# Altium project Zynq7000_Eval_Board.PrjPcb (part 1 of 2)
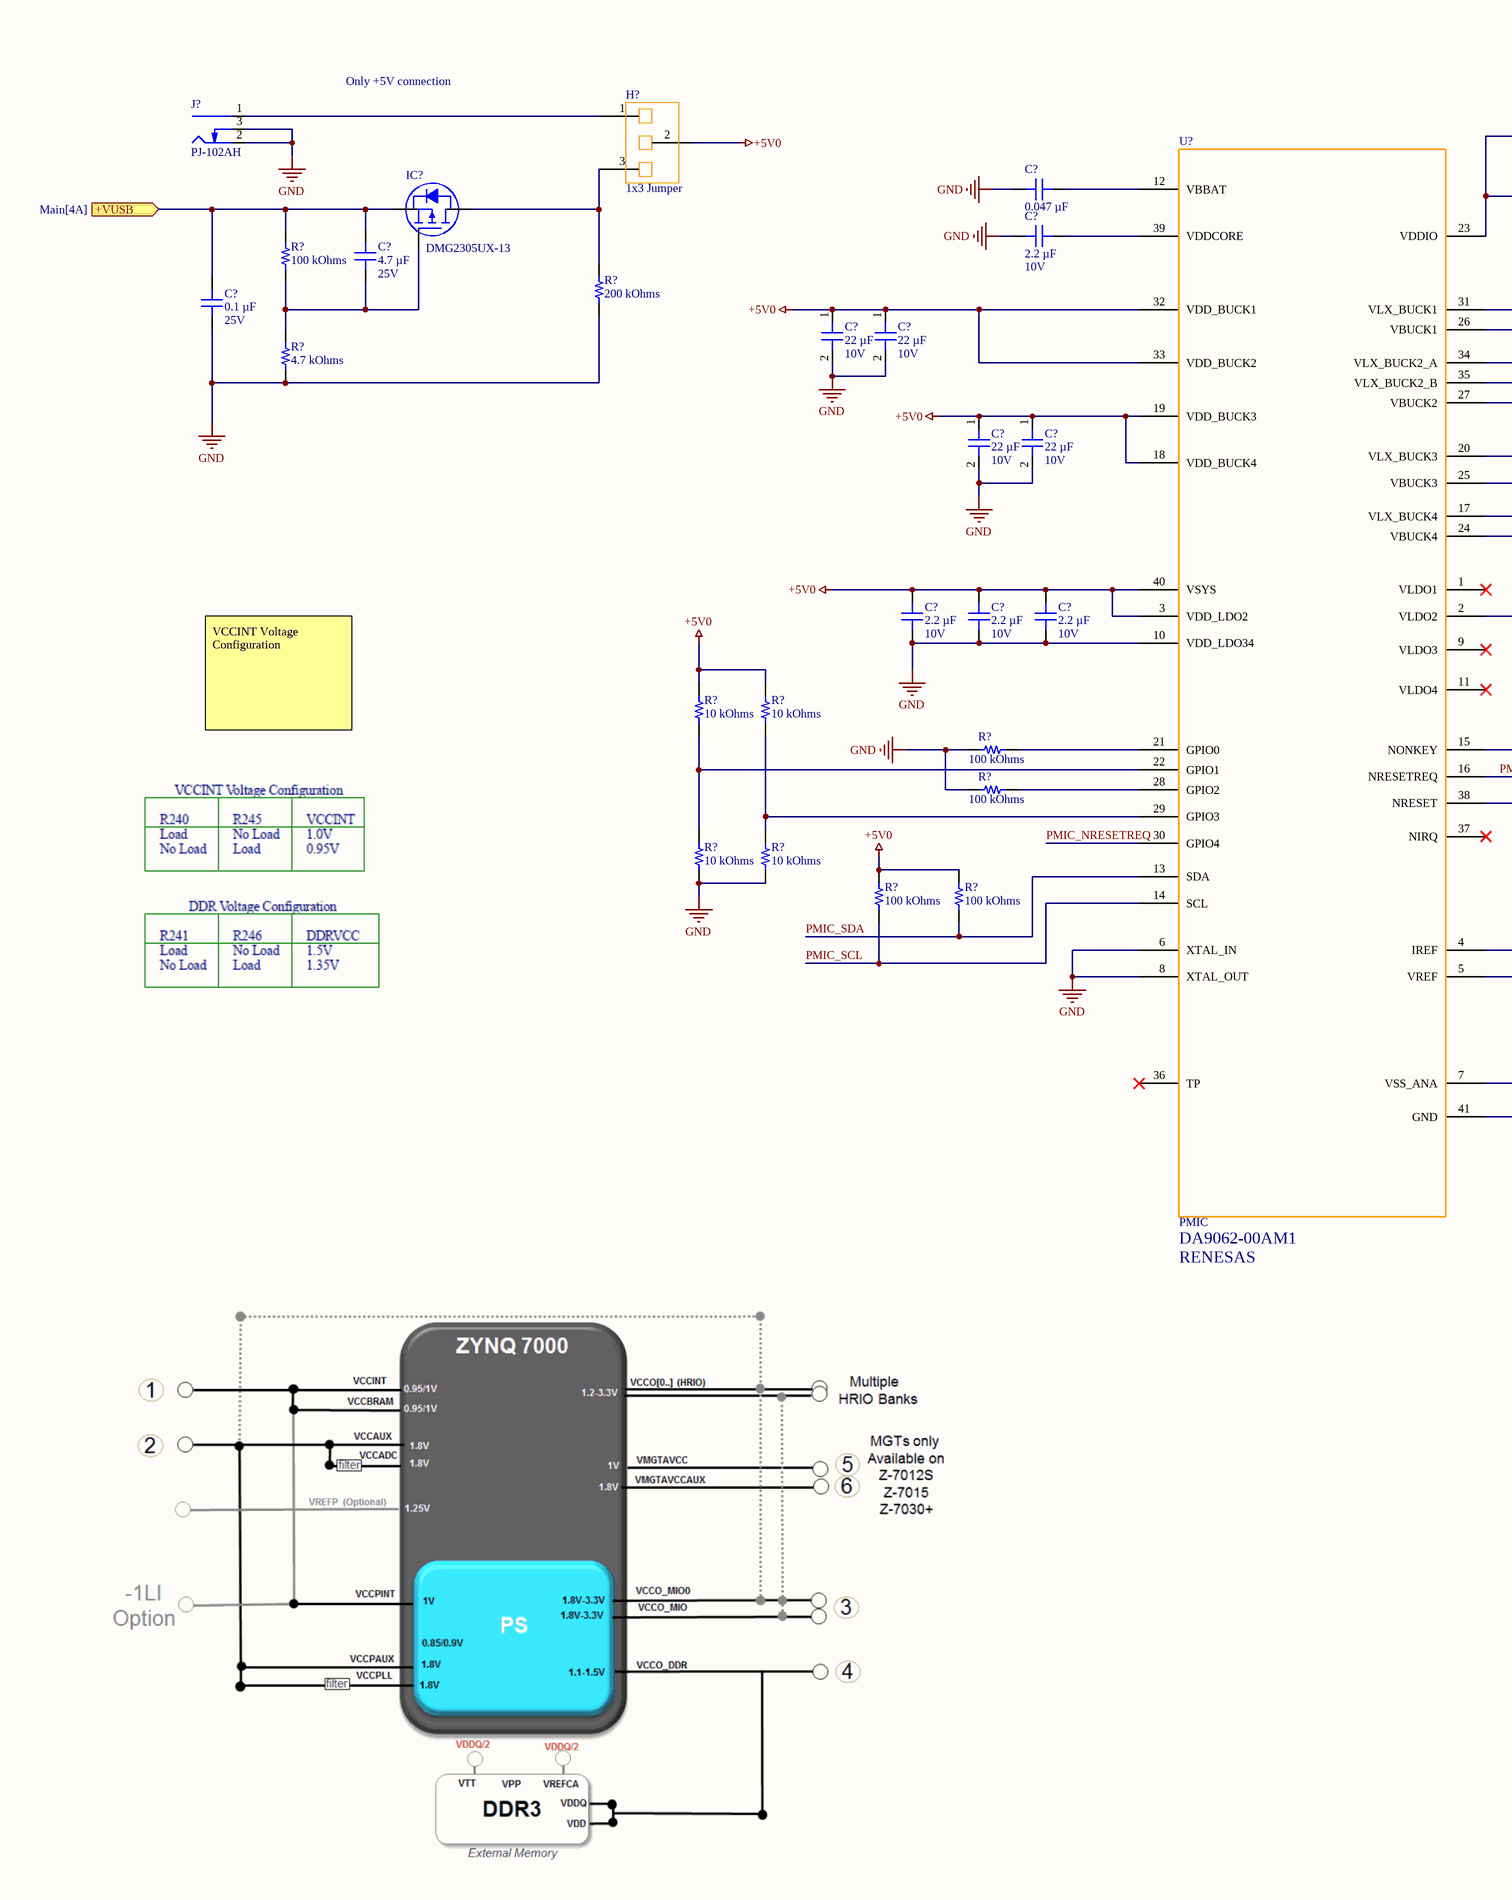
[diagram p0: [02] - POWER.SchDoc, left]
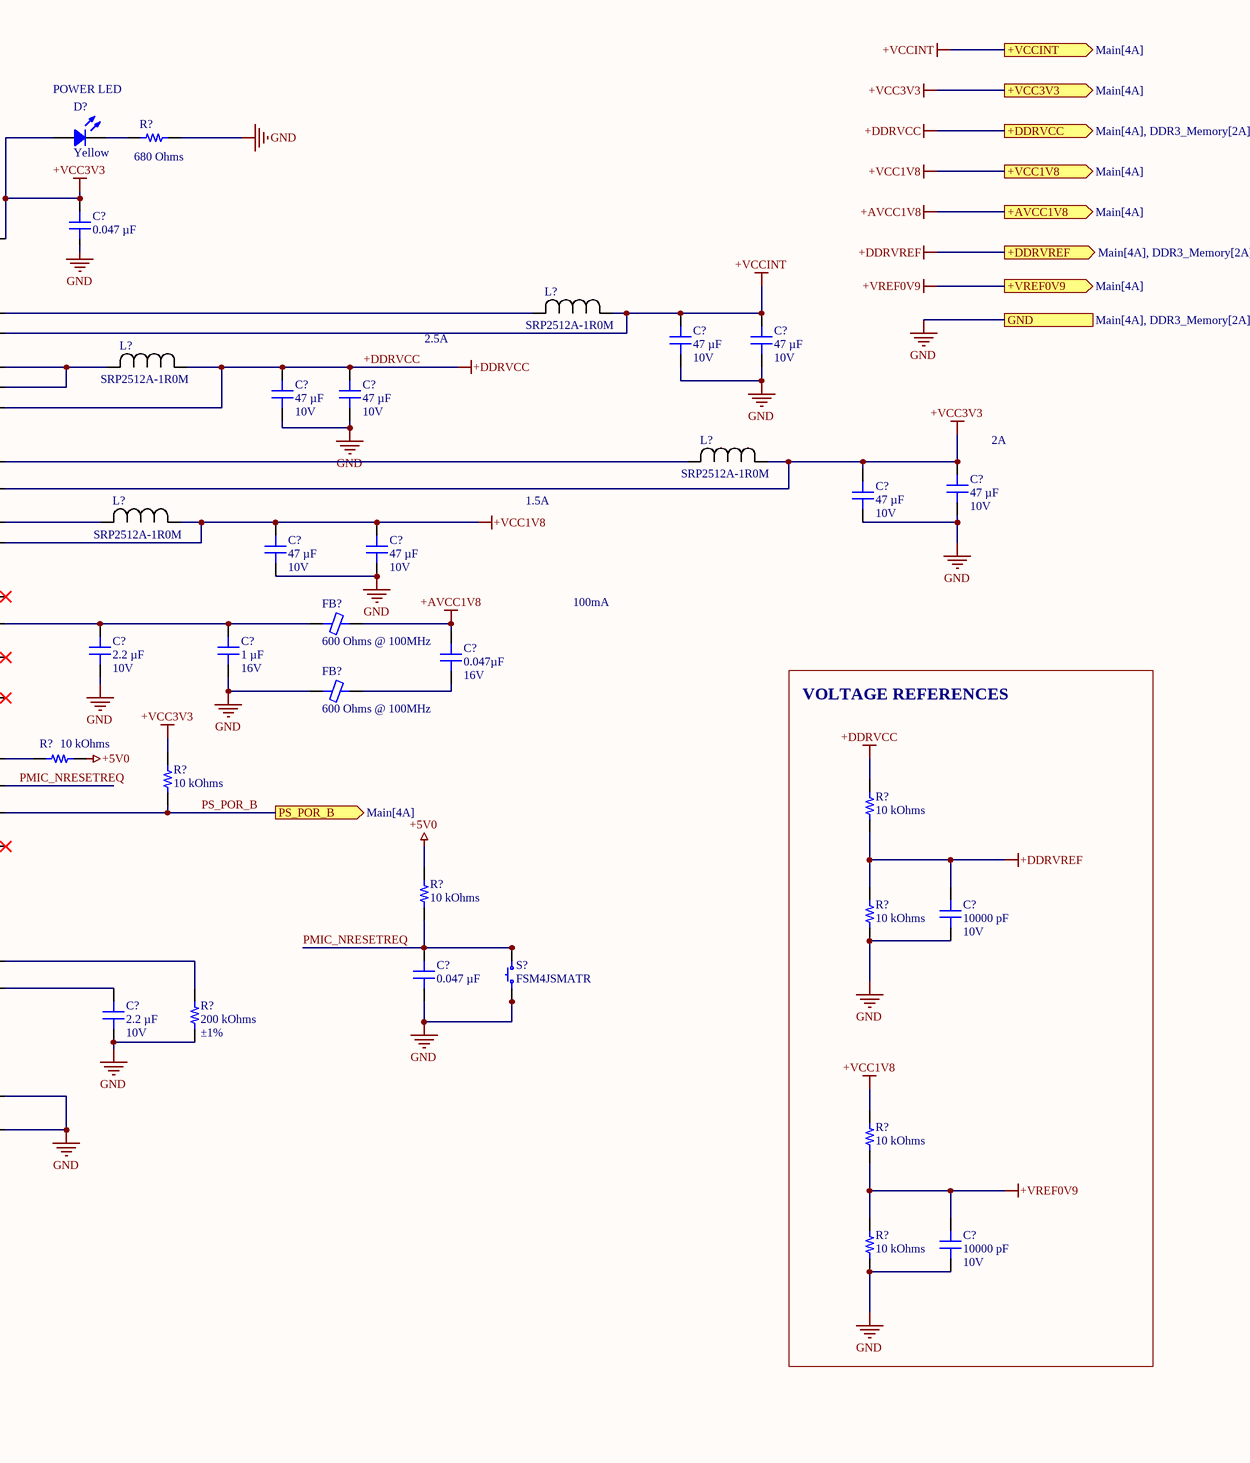
[diagram p1: [02] - POWER.SchDoc, right]
5 sheets, 182 parts. Net scope: flat (ports and power ports of the same name join across sheets).
Sheets:
  [01] - MAIN.SchDoc
  [02] - POWER.SchDoc
  [03] - FPGA - POWER.SchDoc
  [04] - FPGA - DDR3, DDR3 MEM.SchDoc
  [05] - FPGA - USB HOST.SchDoc

## Sheet [01] - MAIN.SchDoc
size A2; SheetNumber: 1; SheetTotal: 5

## Sheet [02] - POWER.SchDoc
size A2; SheetNumber: 5; SheetTotal: 5

### Parts
(Parts that share a designator on the sheet are numbered #1, #2 ... from top to bottom, then left to right.)
C?#1  0.047 µF  [CAP 0402_1005]
C?#2  0.047 µF  [CAP 0402_1005]
C?#3  Voltage - Rated: 10V  [CAP 0603_1608]  (hidden comment: 2.2 µF)
C?#4  Voltage - Rated: 25V  [CAP 0603_1608]  (hidden comment: 4.7 µF)
C?#5  Voltage - Rated: 25V  [CAP 0402_1005]  (hidden comment: 0.1 µF)
C?#6  Voltage - Rated: 10V  [CAP 0805_2012]  (hidden comment: 22 µF)
C?#7  Voltage - Rated: 10V  [CAP 0805_2012]  (hidden comment: 22 µF)
C?#8  Voltage - Rated: 10V  [CAP 0805_2012]  (hidden comment: 47 µF)
C?#9  Voltage - Rated: 10V  [CAP 0805_2012]  (hidden comment: 47 µF)
C?#10  Voltage - Rated: 10V  [CAP 0805_2012]  (hidden comment: 47 µF)
C?#11  Voltage - Rated: 10V  [CAP 0805_2012]  (hidden comment: 47 µF)
C?#12  Voltage - Rated: 10V  [CAP 0805_2012]  (hidden comment: 22 µF)
C?#13  Voltage - Rated: 10V  [CAP 0805_2012]  (hidden comment: 22 µF)
C?#14  Voltage - Rated: 10V  [CAP 0805_2012]  (hidden comment: 47 µF)
C?#15  Voltage - Rated: 10V  [CAP 0805_2012]  (hidden comment: 47 µF)
C?#16  Voltage - Rated: 10V  [CAP 0805_2012]  (hidden comment: 47 µF)
C?#17  Voltage - Rated: 10V  [CAP 0805_2012]  (hidden comment: 47 µF)
C?#18  Voltage - Rated: 10V  [CAP 0603_1608]  (hidden comment: 2.2 µF)
C?#19  Voltage - Rated: 10V  [CAP 0603_1608]  (hidden comment: 2.2 µF)
C?#20  Voltage - Rated: 10V  [CAP 0603_1608]  (hidden comment: 2.2 µF)
C?#21  Voltage - Rated: 10V  [CAP 0603_1608]  (hidden comment: 2.2 µF)
C?#22  Voltage - Rated: 16V  [CAP 0402_1005]  (hidden comment: 1 µF)
C?#23  Voltage - Rated: 16V  [CAP 0402_1005]  (hidden comment: 0.047µF)
C?#24  Voltage - Rated: 10V  [CAP 0201_0603]  (hidden comment: 10000 pF)
C?#25  0.047 µF  [CAP 0402_1005]
C?#26  Voltage - Rated: 10V  [CAP 0603_1608]  (hidden comment: 2.2 µF)
C?#27  Voltage - Rated: 10V  [CAP 0201_0603]  (hidden comment: 10000 pF)
D?#1  Yellow  [LED 1206_3216 YELLOW]
FB?#1  600 Ohms @ 100MHz  [FER 0603_1608]
FB?#2  600 Ohms @ 100MHz  [FER 0603_1608]
H?  1x3 Jumper  [1x3 Header]
IC?  DMG2305UX-13  [DIODES SOT-23-3]
J?#1  PJ-102AH  [CUI PJ-102AH]
L?#1  Manufacturer Part Number: SRP2512A-1R0M  [SRP2512A]  (hidden comment: Inductor)
L?#2  Manufacturer Part Number: SRP2512A-1R0M  [SRP2512A]  (hidden comment: Inductor)
L?#3  Manufacturer Part Number: SRP2512A-1R0M  [SRP2512A]  (hidden comment: Inductor)
L?#4  Manufacturer Part Number: SRP2512A-1R0M  [SRP2512A]  (hidden comment: Inductor)
R?#1  680 Ohms  [RES 0402_1005]
R?#2  100 kOhms  [RES 0402_1005]
R?#3  200 kOhms  [RES 0402_1005]
R?#4  4.7 kOhms  [RES 0402_1005]
R?#5  10 kOhms  [RES 0402_1005]
R?#6  10 kOhms  [RES 0402_1005]
R?#7  100 kOhms  [RES 0402_1005]
R?#8  10 kOhms  [RES 0402_1005]
R?#9  10 kOhms  [RES 0402_1005]
R?#10  100 kOhms  [RES 0402_1005]
R?#11  10 kOhms  [RES 0402_1005]
R?#12  10 kOhms  [RES 0402_1005]
R?#13  10 kOhms  [RES 0402_1005]
R?#14  10 kOhms  [RES 0402_1005]
R?#15  100 kOhms  [RES 0402_1005]
R?#16  100 kOhms  [RES 0402_1005]
R?#17  10 kOhms  [RES 0402_1005]
R?#18  Tolerance: ±1%  [RES 0402_1005]  (hidden comment: 200 kOhms)
R?#19  10 kOhms  [RES 0402_1005]
R?#20  10 kOhms  [RES 0402_1005]
S?  FSM4JSMATR  [TE FSM4JSMA]
U?#1  PMIC  Manufacturer Part Number: DA9062-00AM1  Manufacturer: RENESAS  [DA9062]

### Blocks framed on the sheet
VOLTAGE REFERENCES: C?#24 C?#27 R?#11 R?#17 R?#19 R?#20

### Ports
+AVCC1V8 (out, see Main[4A]), +DDRVCC (out, see Main[4A], DDR3_Memory[2A]), +DDRVREF (out, see Main[4A], DDR3_Memory[2A]), +VCC1V8 (out, see Main[4A]), +VCC3V3 (out, see Main[4A]), +VCCINT (out, see Main[4A]), +VREF0V9 (out, see Main[4A]), +VUSB (in, see Main[4A]), GND (see Main[4A], DDR3_Memory[2A], FPGA_Power[1A]), PS_POR_B (out, see Main[4A])

### Nets
+5V0: C?#6.1 C?#7.1 C?#12.1 C?#13.1 C?#18.2 C?#19.2 C?#20.2 H?.2 R?#5.2 R?#6.2 R?#8.1 R?#14.2 R?#15.1 R?#16.2 U?#1.3(VDD_LDO2) U?#1.18(VDD_BUCK4) U?#1.19(VDD_BUCK3) U?#1.32(VDD_BUCK1) U?#1.33(VDD_BUCK2) U?#1.40(VSYS)
+AVCC1V8: C?#23.2 FB?#1.2 ; port +AVCC1V8
+DDRVCC: C?#10.2 C?#11.2 L?#2.1 R?#11.2 U?#1.27(VBUCK2) ; port +DDRVCC
+DDRVREF: C?#24.2 R?#11.1 R?#17.2 ; port +DDRVREF
+VCC1V8: C?#16.2 C?#17.2 L?#4.1 R?#19.2 U?#1.24(VBUCK4) ; port +VCC1V8
+VCC3V3: C?#2.2 C?#14.2 C?#15.2 D?#1.1 L?#3.1 R?#9.2 U?#1.23(VDDIO) U?#1.25(VBUCK3) ; port +VCC3V3
+VCCINT: C?#8.2 C?#9.2 L?#1.1 U?#1.26(VBUCK1) ; port +VCCINT
+VREF0V9: C?#27.2 R?#19.1 R?#20.2 ; port +VREF0V9
GND: C?#1.1 C?#2.1 C?#3.2 C?#5.1 C?#6.2 C?#7.2 C?#8.1 C?#9.1 C?#10.1 C?#11.1 C?#12.2 C?#13.2 C?#14.1 C?#15.1 C?#16.1 C?#17.1 C?#18.1 C?#19.1 C?#20.1 C?#21.1 C?#22.1 C?#24.1 C?#25.1 C?#26.1 C?#27.1 FB?#2.1 J?#1.2(Outer) J?#1.3(SW) R?#1.2 R?#3.1 R?#4.1 R?#7.1 R?#10.1 R?#12.1 R?#13.1 R?#17.1 R?#18.1 R?#20.1 S?.1 S?.2 U?#1.6(XTAL_IN) U?#1.7(VSS_ANA) U?#1.8(XTAL_OUT) U?#1.10(VDD_LDO34) U?#1.41(GND) ; port GND
PMIC_NRESETREQ: C?#25.2 R?#14.1 S?.3 S?.4 U?#1.16(NRESETREQ) U?#1.30(GPIO4)
PMIC_SCL: R?#15.2 U?#1.14(SCL)
PMIC_SDA: R?#16.1 U?#1.13(SDA)
PS_POR_B: R?#9.1 U?#1.38(NRESET) ; port PS_POR_B
NetC?#1_2: C?#1.2 U?#1.12(VBBAT)
NetC?#3_1: C?#3.1 U?#1.39(VDDCORE)
NetC?#4_1: C?#4.1 IC?.1(G) R?#2.1 R?#4.2
NetC?#4_2: C?#4.2 C?#5.2 IC?.2(S) R?#2.2 ; port +VUSB
NetC?#21_2: C?#21.2 C?#22.2 FB?#1.1 U?#1.2(VLDO2)
NetC?#23_1: C?#23.1 FB?#2.2
NetC?#26_2: C?#26.2 U?#1.5(VREF)
NetD?#1_2: D?#1.2 R?#1.1
NetH?_1: H?.1 J?#1.1(Centre)
NetH?_3: H?.3 IC?.3(D) R?#3.2
NetL?#1_2: L?#1.2 U?#1.31(VLX_BUCK1)
NetL?#2_2: L?#2.2 U?#1.34(VLX_BUCK2_A) U?#1.35(VLX_BUCK2_B)
NetL?#3_2: L?#3.2 U?#1.20(VLX_BUCK3)
NetL?#4_2: L?#4.2 U?#1.17(VLX_BUCK4)
NetR?#5_1: R?#5.1 R?#12.2 U?#1.22(GPIO1)
NetR?#6_1: R?#6.1 R?#13.2 U?#1.29(GPIO3)
NetR?#7_2: R?#7.2 U?#1.21(GPIO0)
NetR?#8_2: R?#8.2 U?#1.15(NONKEY)
NetR?#10_2: R?#10.2 U?#1.28(GPIO2)
NetR?#18_2: R?#18.2 U?#1.4(IREF)

Not connected (* = marked no-connect by the designer): U?#1 1(VLDO1)* 9(VLDO3)* 11(VLDO4)* 36(TP)* 37(NIRQ)*

### Notes on the sheet
- Only +5V connection
- POWER LED
- 2.5A
- (near C?#14) 2A
- 1.5A
- 100mA
- VCCINT Voltage Configuration

### Library data of the parts
C?#1 C?#2 C?#25 = MSAST105SB7473MFNA01: CAP CER 0.047UF 25V X7R 0402; manufacturer: Taiyo Yuden; Tolerance: ±20%; Part Number: MSAST105SB7473MFNA01; Value: 0.047 µF; Applications: General Purpose; Capacitance: 0.047 µF; componentlink2description: DigiKey Link; componentlink2url: https://www.digikey.com/en/products/detail/taiyo-yuden/MSAST105SB7473MFNA01/16667723; Device Package: 0402 (1005 Metric); lastupdated: 24.04.2023 19:04:05; Lifecycle Status: Active; Minimum Order: 1; Mounting Type: Surface Mount, MLCC; Operating Temperature: -55°C ~ 125°C; Package / Case: 0402 (1005 Metric); packaging: CutTape; partid: 47075; Part Status: Active; price: 0.01; series: MSAS; Size / Dimension: 0.039" L x 0.020" W (1.00mm x 0.50mm); Supplier 1: DigiKey; Supplier Part Number 1: 587-MSAST105SB7473MFNA01CT-ND; Temperature Coefficient: X7R; Thickness (Max): 0.022" (0.55mm); Voltage - Rated: 25V
C?#3 C?#18-C?#21 C?#26 = CC0603ZRY5V6BB225: CAP CER 2.2UF 10V Y5V 0603; manufacturer: Yageo; Temperature Coefficient: Y5V (F); Tolerance: -20%, +80%; Part Number: CC0603ZRY5V6BB225; Value: 2.2 µF; Applications: General Purpose; Capacitance: 2.2 µF; componentlink1description: Datasheet; componentlink1url: http://www.yageo.com/documents/recent/UPY-GPHC_Y5V_6.3V-to-50V_8.pdf; componentlink2description: DigiKey Link; componentlink2url: https://www.digikey.com/en/products/detail/yageo/CC0603ZRY5V6BB225/2833615; Device Package: 0603 (1608 Metric); lastupdated: 24.04.2023 19:09:27; Lifecycle Status: Active; Minimum Order: 1; Mounting Type: Surface Mount, MLCC; Operating Temperature: -30°C ~ 85°C; Package / Case: 0603 (1608 Metric); packaging: TapeAndReel; partid: 2248; Part Status: Active; price: 0.01; series: CC; Size / Dimension: 0.063" L x 0.031" W (1.60mm x 0.80mm); Supplier 1: DigiKey; Supplier Part Number 1: 311-1450-1-ND; Thickness (Max): 0.035" (0.90mm)
C?#4 = CL10A475KA8NQNC: CAP CER 4.7UF 25V X5R 0603; manufacturer: Samsung Electro-Mechanics; Tolerance: ±10%; Part Number: CL10A475KA8NQNC; Value: 4.7 µF; Applications: General Purpose; Capacitance: 4.7 µF; componentlink1description: Datasheet; componentlink1url: http://www.samsungsem.com/kr/support/product-search/mlcc/CL10A475KA8NQNC.jsp; componentlink2description: DigiKey Link; componentlink2url: https://www.digikey.com/en/products/detail/samsung-electro-mechanics/CL10A475KA8NQNC/3887558; Device Package: 0603 (1608 Metric); lastupdated: 25.04.2023 19:09:30; Lifecycle Status: Active; Minimum Order: 1; Mounting Type: Surface Mount, MLCC; Operating Temperature: -55°C ~ 85°C; Package / Case: 0603 (1608 Metric); packaging: TapeAndReel; partid: 2349; Part Status: Active; price: 0.06; series: CL; Size / Dimension: 0.063" L x 0.031" W (1.60mm x 0.80mm); Supplier 1: DigiKey; Supplier Part Number 1: 1276-1900-1-ND; Temperature Coefficient: X5R; Thickness (Max): 0.035" (0.90mm)
C?#5 = 04023C104KAT2A-62: 0402 25V X7R 100 NF 10%; manufacturer: KYOCERA AVX; Part Number: 04023C104KAT2A-62; Value: 0.1 µF; Applications: General Purpose; Capacitance: 0.1 µF; componentlink1description: Datasheet; componentlink1url: https://datasheets.kyocera-avx.com/X7RDielectric.pdf; componentlink2description: DigiKey Link; componentlink2url: https://www.digikey.com/en/products/detail/kyocera-avx/04023C104KAT2A-62/17868566; Device Package: 0402 (1005 Metric); lastupdated: 25.04.2023 19:03:40; Lifecycle Status: Active; Minimum Order: 1; Mounting Type: Surface Mount, MLCC; Operating Temperature: -55°C ~ 125°C; Package / Case: 0402 (1005 Metric); packaging: TapeAndReel; partid: 48205; Part Status: Active; price: 0.07; series: -; Size / Dimension: 0.039" L x 0.020" W (1.00mm x 0.50mm); Supplier 1: DigiKey; Supplier Part Number 1: 478-04023C104KAT2A-62CT-ND; Temperature Coefficient: X7R; Thickness (Max): 0.022" (0.56mm); Tolerance: ±10%
C?#6 C?#7 C?#12 C?#13 = LMK212BJ226MG-T: CAP CER 22UF 10V X5R 0805; manufacturer: Taiyo Yuden; Tolerance: ±20%; Part Number: LMK212BJ226MG-T; Value: 22 µF; Applications: SMPS Filtering; Capacitance: 22 µF; componentlink1description: Datasheet; componentlink1url: https://www.yuden.co.jp/productdata/catalog/mlcc01_e.pdf; componentlink2description: DigiKey Link; componentlink2url: https://www.digikey.com/en/products/detail/taiyo-yuden/LMK212BJ226MG-T/1646587; Device Package: 0805 (2012 Metric); lastupdated: 24.04.2023 19:13:05; Lifecycle Status: Active; Minimum Order: 1; Mounting Type: Surface Mount, MLCC; Operating Temperature: -55°C ~ 85°C; Package / Case: 0805 (2012 Metric); packaging: TapeAndReel; partid: 3025; Part Status: Active; price: 0.06; series: M; Size / Dimension: 0.079" L x 0.049" W (2.00mm x 1.25mm); Supplier 1: DigiKey; Supplier Part Number 1: 587-1958-1-ND; Temperature Coefficient: X5R; Thickness (Max): 0.053" (1.35mm)
C?#8-C?#11 C?#14-C?#17 = GRM21BR61A476ME15L: CAP CER 47UF 10V X5R 0805; manufacturer: Murata Electronics; Tolerance: ±20%; Part Number: GRM21BR61A476ME15L; Value: 47 µF; Applications: General Purpose; Capacitance: 47 µF; componentlink1description: Datasheet; componentlink1url: https://search.murata.co.jp/Ceramy/image/img/A01X/G101/ENG/GRM21BR61A476ME15-01.pdf; componentlink2description: DigiKey Link; componentlink2url: https://www.digikey.com/en/products/detail/murata-electronics/GRM21BR61A476ME15L/4905529; Device Package: 0805 (2012 Metric); lastupdated: 24.04.2023 19:13:01; Lifecycle Status: Active; Minimum Order: 1; Mounting Type: Surface Mount, MLCC; Operating Temperature: -55°C ~ 85°C; Package / Case: 0805 (2012 Metric); packaging: TapeAndReel; partid: 40304; Part Status: Active; price: 0.16; series: GRM; Size / Dimension: 0.079" L x 0.049" W (2.00mm x 1.25mm); Supplier 1: DigiKey; Supplier Part Number 1: 490-9961-1-ND; Temperature Coefficient: X5R; Thickness (Max): 0.057" (1.45mm)
C?#22 = GMC04X5R105K16NT: CAP0402 X5R 1UF 10% 16V; manufacturer: Cal-Chip Electronics, Inc.; Part Number: GMC04X5R105K16NT; Value: 1 µF; Applications: General Purpose; Capacitance: 1 µF; componentlink1description: Datasheet; componentlink1url: https://88ce57.p3cdn1.secureserver.net/wp-content/uploads/2023/01/gmc_series-2.pdf; componentlink2description: DigiKey Link; componentlink2url: https://www.digikey.com/en/products/detail/cal-chip-electronics-inc/GMC04X5R105K16NT/18151143; Device Package: 0402 (1005 Metric); lastupdated: 24.04.2023 19:03:50; Lifecycle Status: Active; Minimum Order: 1; Mounting Type: Surface Mount, MLCC; Operating Temperature: -55°C ~ 85°C; Package / Case: 0402 (1005 Metric); packaging: TapeAndReel; partid: 49824; Part Status: Active; price: 0.01; series: GMC; Size / Dimension: 0.039" L x 0.020" W (1.00mm x 0.50mm); Supplier 1: DigiKey; Supplier Part Number 1: 4713-GMC04X5R105K16NTCT-ND; Temperature Coefficient: X5R; Thickness (Max): 0.022" (0.55mm); Tolerance: ±10%
C?#23 = 0402YD473KAT2A: CAP CER 0.047UF 16V X5R 0402; manufacturer: AVX Corporation; Tolerance: ±10%; Part Number: 0402YD473KAT2A; Value: 0.047µF; Applications: General Purpose; Capacitance: 0.047µF; componentlink1description: Datasheet; componentlink1url: http://datasheets.avx.com/cx5r.pdf; componentlink2description: DigiKey Link; componentlink2url: http://digikey.com/product-detail/en/avx-corporation/0402YD473KAT2A/478-1125-1-ND/564157; Device Package: 0402 (1005 Metric); lastupdated: 8.02.2022 12:26:58; Lifecycle Status: Active; Minimum Order: 1; Mounting Type: Surface Mount, MLCC; Operating Temperature: -55°C ~ 85°C; Package / Case: 0402 (1005 Metric); packaging: TapeAndReel; partid: 1776; Part Status: Active; price: 0.02; series: -; Size / Dimension: 0.039" L x 0.020" W (1.00mm x 0.50mm); Supplier 1: DigiKey; Supplier Part Number 1: 478-1125-1-ND; Temperature Coefficient: X5R; Thickness (Max): 0.022" (0.56mm)
C?#24 C?#27 = MAASL063SB7103MFCA01: CAP CER 0.01UF 10V X7R 0201; manufacturer: Taiyo Yuden; Tolerance: ±20%; Part Number: MAASL063SB7103MFCA01; Value: 10000 pF; Applications: Automotive; Capacitance: 10000 pF; componentlink1description: Datasheet; componentlink1url: https://media.digikey.com/pdf/Data%20Sheets/Taiyo%20Yuden%20PDFs%20URL%20links/MAASL063SB7103MFCA01_SS.pdf; componentlink2description: DigiKey Link; componentlink2url: https://www.digikey.com/en/products/detail/taiyo-yuden/MAASL063SB7103MFCA01/18109005; Device Package: 0201 (0603 Metric); Height - Seated (Max): 0.013" (0.33mm); lastupdated: 27.04.2023 19:00:59; Lifecycle Status: Active; Minimum Order: 1; Mounting Type: Surface Mount, MLCC; Operating Temperature: -55°C ~ 125°C; Package / Case: 0201 (0603 Metric); packaging: TapeAndReel; partid: 47946; Part Status: Active; price: 0.01; Ratings: AEC-Q200; series: MAAS; Size / Dimension: 0.024" L x 0.012" W (0.60mm x 0.30mm); Supplier 1: DigiKey; Supplier Part Number 1: 587-MAASL063SB7103MFCA01CT-ND; Temperature Coefficient: X7R; Thickness (Max): 0.013" (0.33mm)
D?#1 = 5990240007F: LED YELLOW 1206 SMD; Manufacturer: Dialight; Configuration: Standard; Current - Test: 20mA; Lens Color: 0.80mm; Lens Size: 2.00mm x 1.60mm; Lens Style: Rectangle with Flat Top; Millicandela Rating: 126mcd; Viewing Angle: 140°; Voltage - Forward (Vf) (Typ): 2.1V; Wavelength - Dominant: 590nm; Part Number: 5990240007F; Color: Yellow; ComponentLink1Description: Datasheet; ComponentLink1URL: http://www.dialightsignalsandcomponents.com/Assets/Brochures_And_Catalogs/Indication/CBI_SMD_new/Dialight_CBI_data_599-1206_Apr2018.pdf; ComponentLink2Description: DigiKey Link; ComponentLink2URL: https://www.digikey.com/en/products/detail/dialight/5990240007F/9385418; Device Package: 1206 (3216 Metric); Height (Max): 0.80mm; LastUpdated: 24.04.2023 20:07:19; Lifecycle Status: Active; Minimum Order: 1; Mounting Type: Surface Mount; Package / Case: 1206 (3216 Metric); Packaging: TapeAndReel; PartId: 1; Part Status: Active; Price: 0.04; Series: 599; Size / Dimension: 3.20mm L x 1.60mm W; Supplier 1: DigiKey; Supplier Part Number 1: 350-4363-1-ND; Supplier Device Package: 1206; Value: Yellow
FB?#1 FB?#2 = BLM18DN601SZ1D: FERRITEBEAD SMD Z100MHZ=600OHM 7; Manufacturer: Murata Electronics; Current Rating (Max): 700mA; Number of Lines: 1; Part Number: BLM18DN601SZ1D; ComponentLink1Description: Datasheet; ComponentLink1URL: https://www.murata.com/en-us/api/pdfdownloadapi?cate=luNoiseSupprFilteChipFerriBead&partno=BLM18DN601SZ1%23; ComponentLink2Description: DigiKey Link; ComponentLink2URL: http://digikey.com/product-detail/en/murata-electronics/BLM18DN601SZ1D/490-18575-1-ND/10135586; Device Package: 0603 (1608 Metric); Height (Max): 0.037" (0.95mm); Impedance @ Frequency: 600 Ohms @ 100MHz; LastUpdated: 2.09.2020 01:18:18; Lifecycle Status: Active; Minimum Order: 1; Mounting Type: Surface Mount; Operating Temperature: -55°C ~ 125°C; Package / Case: 0603 (1608 Metric); Packaging: TapeAndReel; PartId: 783; Part Status: Active; Price: 0.05; Ratings: AEC-Q200; Series: EMIFIL®, BLM18; Size / Dimension: 0.063" L x 0.031" W (1.60mm x 0.80mm); Supplier 1: DigiKey; Supplier Part Number 1: 490-18575-1-ND; Value: 600 Ohms @ 100MHz
IC? = DMG2305UX-13: MOSFET P-CH 20V 4.2A SOT23; Manufacturer: Diodes Incorporated; Current - Continuous Drain (Id) @ 25°C: 4.2A (Ta); Drive Voltage (Max Rds On,  Min Rds On): 1.8V, 4.5V; FET Type: P-Channel; Gate Charge (Qg) (Max) @ Vgs: 10.2 nC @ 4.5 V; Input Capacitance (Ciss) (Max) @ Vds: 808 pF @ 15 V; Power Dissipation (Max): 1.4W (Ta); Rds On (Max) @ Id, Vgs: 52mOhm @ 4.2A, 4.5V; Vgs (Max): ±8V; Vgs(th) (Max) @ Id: 900mV @ 250µA; Part Number: DMG2305UX-13; ComponentLink1Description: Datasheet; ComponentLink1URL: https://www.diodes.com/assets/Datasheets/DMG2305UX.pdf; ComponentLink2Description: DigiKey Link; ComponentLink2URL: https://www.digikey.com/en/products/detail/diodes-incorporated/DMG2305UX-13/4251560; Drain to Source Voltage (Vdss): 20 V; LastUpdated: 25.04.2023 20:07:38; Lifecycle Status: Active; Minimum Order: 1; Mounting Type: Surface Mount; Operating Temperature: -55°C ~ 150°C (TJ); Package / Case: TO-236-3, SC-59, SOT-23-3; Packaging: TapeAndReel; Part Status: Active; Price: 0.04; Series: -; Supplier 1: DigiKey; Supplier Part Number 1: DMG2305UX-13DICT-ND; Supplier Device Package: SOT-23-3; Technology: MOSFET (Metal Oxide)
J?#1 = PJ-102AH: CONN PWR JACK 2X5.5MM SOLDER; Manufacturer: CUI Devices; Actual Diameter: 0.079" (2.00mm ID), 0.256" (6.50mm OD); Current Rating (Amps): 5A; Gender: Male; Industry Recognized Mating Diameter: 2.00mm ID (0.079"), 5.50mm OD (0.217"); Internal Switch(s): Single Switch, Normally Closed; Material Flammability Rating: UL94 V-0; Mating Length/Depth: 0.354" (9.00mm); Number of Positions/Contacts: 2 Conductors, 3 Contacts; Shielding: Unshielded; Voltage - Rated: 24VDC; Part Number: PJ-102AH; ComponentLink1Description: Datasheet; ComponentLink1URL: https://www.cuidevices.com/product/resource/digikeypdf/pj-102ah.pdf; ComponentLink2Description: DigiKey Link; ComponentLink2URL: //digikey.com/product-detail/en/cui-devices/PJ-102AH/CP-102AH-ND/408448; Connector Type: Jack; LastUpdated: 16.12.2019 19:01:27; Lifecycle Status: 0; Minimum Order: 1; Mounting Type: Through Hole, Right Angle; Packaging: Tray; Part Status: Active; Price: 0.76; Series: -; Supplier 1: DigiKey; Supplier Part Number 1: CP-102AH-ND; Termination: Solder
L?#1-L?#4 = SRP2512A: FIXED IND 1UH 3.5A 49 MOHM SMD; Manufacturer: Bourns
R?#1 = ERJ-2RKF6800X: RES SMD 680 OHM 1% 1/10W 0402; Manufacturer: Panasonic Electronic Components; Power (Watts): 0.1W, 1/10W; Temperature Coefficient: ±100ppm/°C; Part Number: ERJ-2RKF6800X; Value: 680 Ohms; ComponentLink1Description: Datasheet; ComponentLink1URL: https://industrial.panasonic.com/cdbs/www-data/pdf/RDA0000/AOA0000C304.pdf; ComponentLink2Description: DigiKey Link; ComponentLink2URL: https://www.digikey.com/en/products/detail/panasonic-electronic-components/ERJ-2RKF6800X/1746268; Composition: Thick Film; Device Package: 0402 (1005 Metric); Features: Automotive AEC-Q200; Height - Seated (Max): 0.016" (0.40mm); LastUpdated: 24.04.2023 19:23:28; Lifecycle Status: Active; Minimum Order: 1; Number of Terminations: 2; Operating Temperature: -55°C ~ 155°C; Package / Case: 0402 (1005 Metric); Packaging: CutTape; PartId: 21210; Part Status: Active; Price: 0.01; Ratings: AEC-Q200; Resistance: 680 Ohms; Series: ERJ-2RK; Size / Dimension: 0.039" L x 0.020" W (1.00mm x 0.50mm); Supplier 1: DigiKey; Supplier Part Number 1: P680LCT-ND; Supplier Device Package: 0402; Tolerance: ±1%
R?#2 = RCS0402100KJNED: RES SMD 100K OHM 5% 1/5W 0402; Manufacturer: Vishay Dale; Power (Watts): 0.2W, 1/5W; Temperature Coefficient: ±200ppm/°C; Part Number: RCS0402100KJNED; Value: 100 kOhms; ComponentLink1Description: Datasheet; ComponentLink1URL: http://www.vishay.com/docs/20065/rcse3.pdf; ComponentLink2Description: DigiKey Link; ComponentLink2URL: https://www.digikey.com/en/products/detail/vishay-dale/RCS0402100KJNED/5867065; Composition: Thick Film; Device Package: 0402 (1005 Metric); Features: Automotive AEC-Q200, Pulse Withstanding; Height - Seated (Max): 0.016" (0.40mm); LastUpdated: 25.04.2023 19:20:06; Lifecycle Status: Active; Minimum Order: 1; Number of Terminations: 2; Operating Temperature: -55°C ~ 155°C; Package / Case: 0402 (1005 Metric); Packaging: TapeAndReel; PartId: 5535; Part Status: Active; Price: 0.01; Ratings: AEC-Q200; Resistance: 100 kOhms; Series: RCS e3; Size / Dimension: 0.039" L x 0.020" W (1.00mm x 0.50mm); Supplier 1: DigiKey; Supplier Part Number 1: 541-2919-1-ND; Supplier Device Package: 0402; Tolerance: ±5%
R?#3 = RC0402JR-07200KL: RES 200K OHM 5% 1/16W 0402; Manufacturer: Yageo; Power (Watts): 0.063W, 1/16W; Temperature Coefficient: ±100ppm/°C; Part Number: RC0402JR-07200KL; Value: 200 kOhms; ComponentLink1Description: Datasheet; ComponentLink1URL: https://www.yageo.com/upload/media/product/productsearch/datasheet/rchip/PYu-RC_Group_51_RoHS_L_10.pdf; ComponentLink2Description: DigiKey Link; ComponentLink2URL: https://www.digikey.com/en/products/detail/yageo/RC0402JR-07200KL/726440; Composition: Thick Film; Device Package: 0402 (1005 Metric); Features: Moisture Resistant; Height - Seated (Max): 0.016" (0.40mm); LastUpdated: 25.04.2023 19:20:07; Lifecycle Status: Active; Minimum Order: 1; Number of Terminations: 2; Operating Temperature: -55°C ~ 155°C; Package / Case: 0402 (1005 Metric); Packaging: CutTape; PartId: 4825; Part Status: Active; Price: 0.01; Resistance: 200 kOhms; Series: RC_L; Size / Dimension: 0.039" L x 0.020" W (1.00mm x 0.50mm); Supplier 1: DigiKey; Supplier Part Number 1: 311-200KJRCT-ND; Supplier Device Package: 0402; Tolerance: ±5%
R?#4 = RC0402JR-074K7P: RES SMD 4.7K OHM 5% 1/16W 0402; Manufacturer: Yageo; Power (Watts): 0.063W, 1/16W; Temperature Coefficient: ±100ppm/°C; Part Number: RC0402JR-074K7P; Value: 4.7 kOhms; ComponentLink1Description: Datasheet; ComponentLink1URL: http://www.yageo.com/NewPortal/yageodocoutput?fileName=/pdf/R-Chip/PYu-RC_51_RoHS_P_0.pdf; ComponentLink2Description: DigiKey Link; ComponentLink2URL: https://www.digikey.com/en/products/detail/yageo/RC0402JR-074K7P/4935302; Composition: Thick Film; Device Package: 0402 (1005 Metric); Features: Moisture Resistant; Height - Seated (Max): 0.016" (0.40mm); LastUpdated: 25.04.2023 19:20:06; Lifecycle Status: Active; Minimum Order: 1; Number of Terminations: 2; Operating Temperature: -55°C ~ 155°C; Package / Case: 0402 (1005 Metric); Packaging: CutTape; PartId: 5281; Part Status: Active; Price: 0.01; Resistance: 4.7 kOhms; Series: RC-P Lead Free; Size / Dimension: 0.039" L x 0.020" W (1.00mm x 0.50mm); Supplier 1: DigiKey; Supplier Part Number 1: YAG1287CT-ND; Supplier Device Package: 0402; Tolerance: ±5%
R?#5 R?#6 R?#8 R?#9 R?#11-R?#14 R?#17 R?#19 R?#20 = CRCW040210K0FKEE: RES SMD 10K OHM 1% 1/16W 0402; Manufacturer: Vishay Dale; Power (Watts): 0.063W, 1/16W; Temperature Coefficient: ±100ppm/°C; Part Number: CRCW040210K0FKEE; Value: 10 kOhms; ComponentLink1Description: Datasheet; ComponentLink1URL: http://www.vishay.com/docs/20035/dcrcwe3.pdf; ComponentLink2Description: DigiKey Link; ComponentLink2URL: https://www.digikey.com/en/products/detail/vishay-dale/CRCW040210K0FKEE/5069897; Composition: Thick Film; Device Package: 0402 (1005 Metric); Features: Automotive AEC-Q200; Height - Seated (Max): 0.016" (0.40mm); LastUpdated: 24.04.2023 19:24:49; Lifecycle Status: Active; Minimum Order: 1; Number of Terminations: 2; Operating Temperature: -55°C ~ 155°C; Package / Case: 0402 (1005 Metric); Packaging: CutTape; PartId: 3471; Part Status: Active; Price: 0.01; Ratings: AEC-Q200; Resistance: 10 kOhms; Series: CRCW; Size / Dimension: 0.039" L x 0.020" W (1.00mm x 0.50mm); Supplier 1: DigiKey; Supplier Part Number 1: 541-2954-1-ND; Supplier Device Package: 0402; Tolerance: ±1%
R?#7 R?#10 R?#15 R?#16 = SR0402FR-7T100KL: RES 100K OHM 1% 1/5W 0402; Manufacturer: Yageo; Power (Watts): 0.2W, 1/5W; Temperature Coefficient: ±100ppm/°C; Part Number: SR0402FR-7T100KL; Value: 100 kOhms; ComponentLink1Description: Datasheet; ComponentLink1URL: http://www.yageo.com/documents/recent/PYu-SR_D_F%20tol_RoHS_L_4.pdf; ComponentLink2Description: DigiKey Link; ComponentLink2URL: https://www.digikey.com/en/products/detail/yageo/SR0402FR-7T100KL/9373087; Composition: Thick Film; Device Package: 0402 (1005 Metric); Features: Automotive AEC-Q200, Pulse Withstanding; Height - Seated (Max): 0.016" (0.40mm); LastUpdated: 24.04.2023 19:24:45; Lifecycle Status: Active; Minimum Order: 1; Number of Terminations: 2; Operating Temperature: -55°C ~ 155°C; Package / Case: 0402 (1005 Metric); Packaging: TapeAndReel; PartId: 4405; Part Status: Active; Price: 0.09; Ratings: AEC-Q200; Resistance: 100 kOhms; Series: SR; Size / Dimension: 0.039" L x 0.020" W (1.00mm x 0.50mm); Supplier 1: DigiKey; Supplier Part Number 1: YAG5813CT-ND; Supplier Device Package: 0402; Tolerance: ±1%
R?#18 = RMCF0402FT200K: RES 200K OHM 1% 1/16W 0402; Manufacturer: Stackpole Electronics Inc; Power (Watts): 0.063W, 1/16W; Temperature Coefficient: ±100ppm/°C; Part Number: RMCF0402FT200K; Value: 200 kOhms; ComponentLink1Description: Datasheet; ComponentLink1URL: https://www.seielect.com/catalog/sei-rmcf_rmcp.pdf; ComponentLink2Description: DigiKey Link; ComponentLink2URL: https://www.digikey.com/en/products/detail/stackpole-electronics-inc/RMCF0402FT200K/1714538; Composition: Thick Film; Device Package: 0402 (1005 Metric); Features: Automotive AEC-Q200; Height - Seated (Max): 0.016" (0.40mm); LastUpdated: 24.04.2023 19:24:41; Lifecycle Status: Active; Minimum Order: 1; Number of Terminations: 2; Operating Temperature: -55°C ~ 155°C; Package / Case: 0402 (1005 Metric); Packaging: CutTape; PartId: 5001; Part Status: Active; Price: 0.01; Ratings: AEC-Q200; Resistance: 200 kOhms; Series: RMCF; Size / Dimension: 0.039" L x 0.020" W (1.00mm x 0.50mm); Supplier 1: DigiKey; Supplier Part Number 1: RMCF0402FT200KCT-ND; Supplier Device Package: 0402
S? = FSM4JSMATR: SWITCH TACTILE SPST-NO 0.05A 24V; Manufacturer: TE Connectivity ALCOSWITCH Switches; Actuator Height off PCB, Vertical: 5.00mm; Actuator Orientation: Top Actuated; Actuator Type: Standard; Contact Rating @ Voltage: 0.05A @ 24VDC; Illumination: Non-Illuminated; Operating Force: 160gf; Outline: 6.00mm x 6.00mm; Switch Function: Off-Mom; Part Number: FSM4JSMATR; Circuit: SPST-NO; ComponentLink1Description: Datasheet; ComponentLink1URL: https://www.te.com/commerce/DocumentDelivery/DDEController?Action=srchrtrv&DocNm=1308111-1_SWITCHES_CORE_PROGRAM_CATALOG&DocType=CS&DocLang=English; ComponentLink2Description: DigiKey Link; ComponentLink2URL: https://www.digikey.com/en/products/detail/te-connectivity-alcoswitch-switches/FSM4JSMATR/529675; LastUpdated: 24.04.2023 20:19:58; Lifecycle Status: Active; Minimum Order: 1; Mounting Type: Surface Mount; Operating Temperature: -35°C ~ 85°C; Packaging: TapeAndReel; Part Status: Active; Price: 0.17; Series: FSMJSMA; Supplier 1: DigiKey; Supplier Part Number 1: 450-1759-1-ND; Termination Style: Gull Wing
U?#1 = DA9062: Designed for Applications Requiring up to 8.5 A

## Sheet [03] - FPGA - POWER.SchDoc
size A2; SheetNumber: 3; SheetTotal: 4
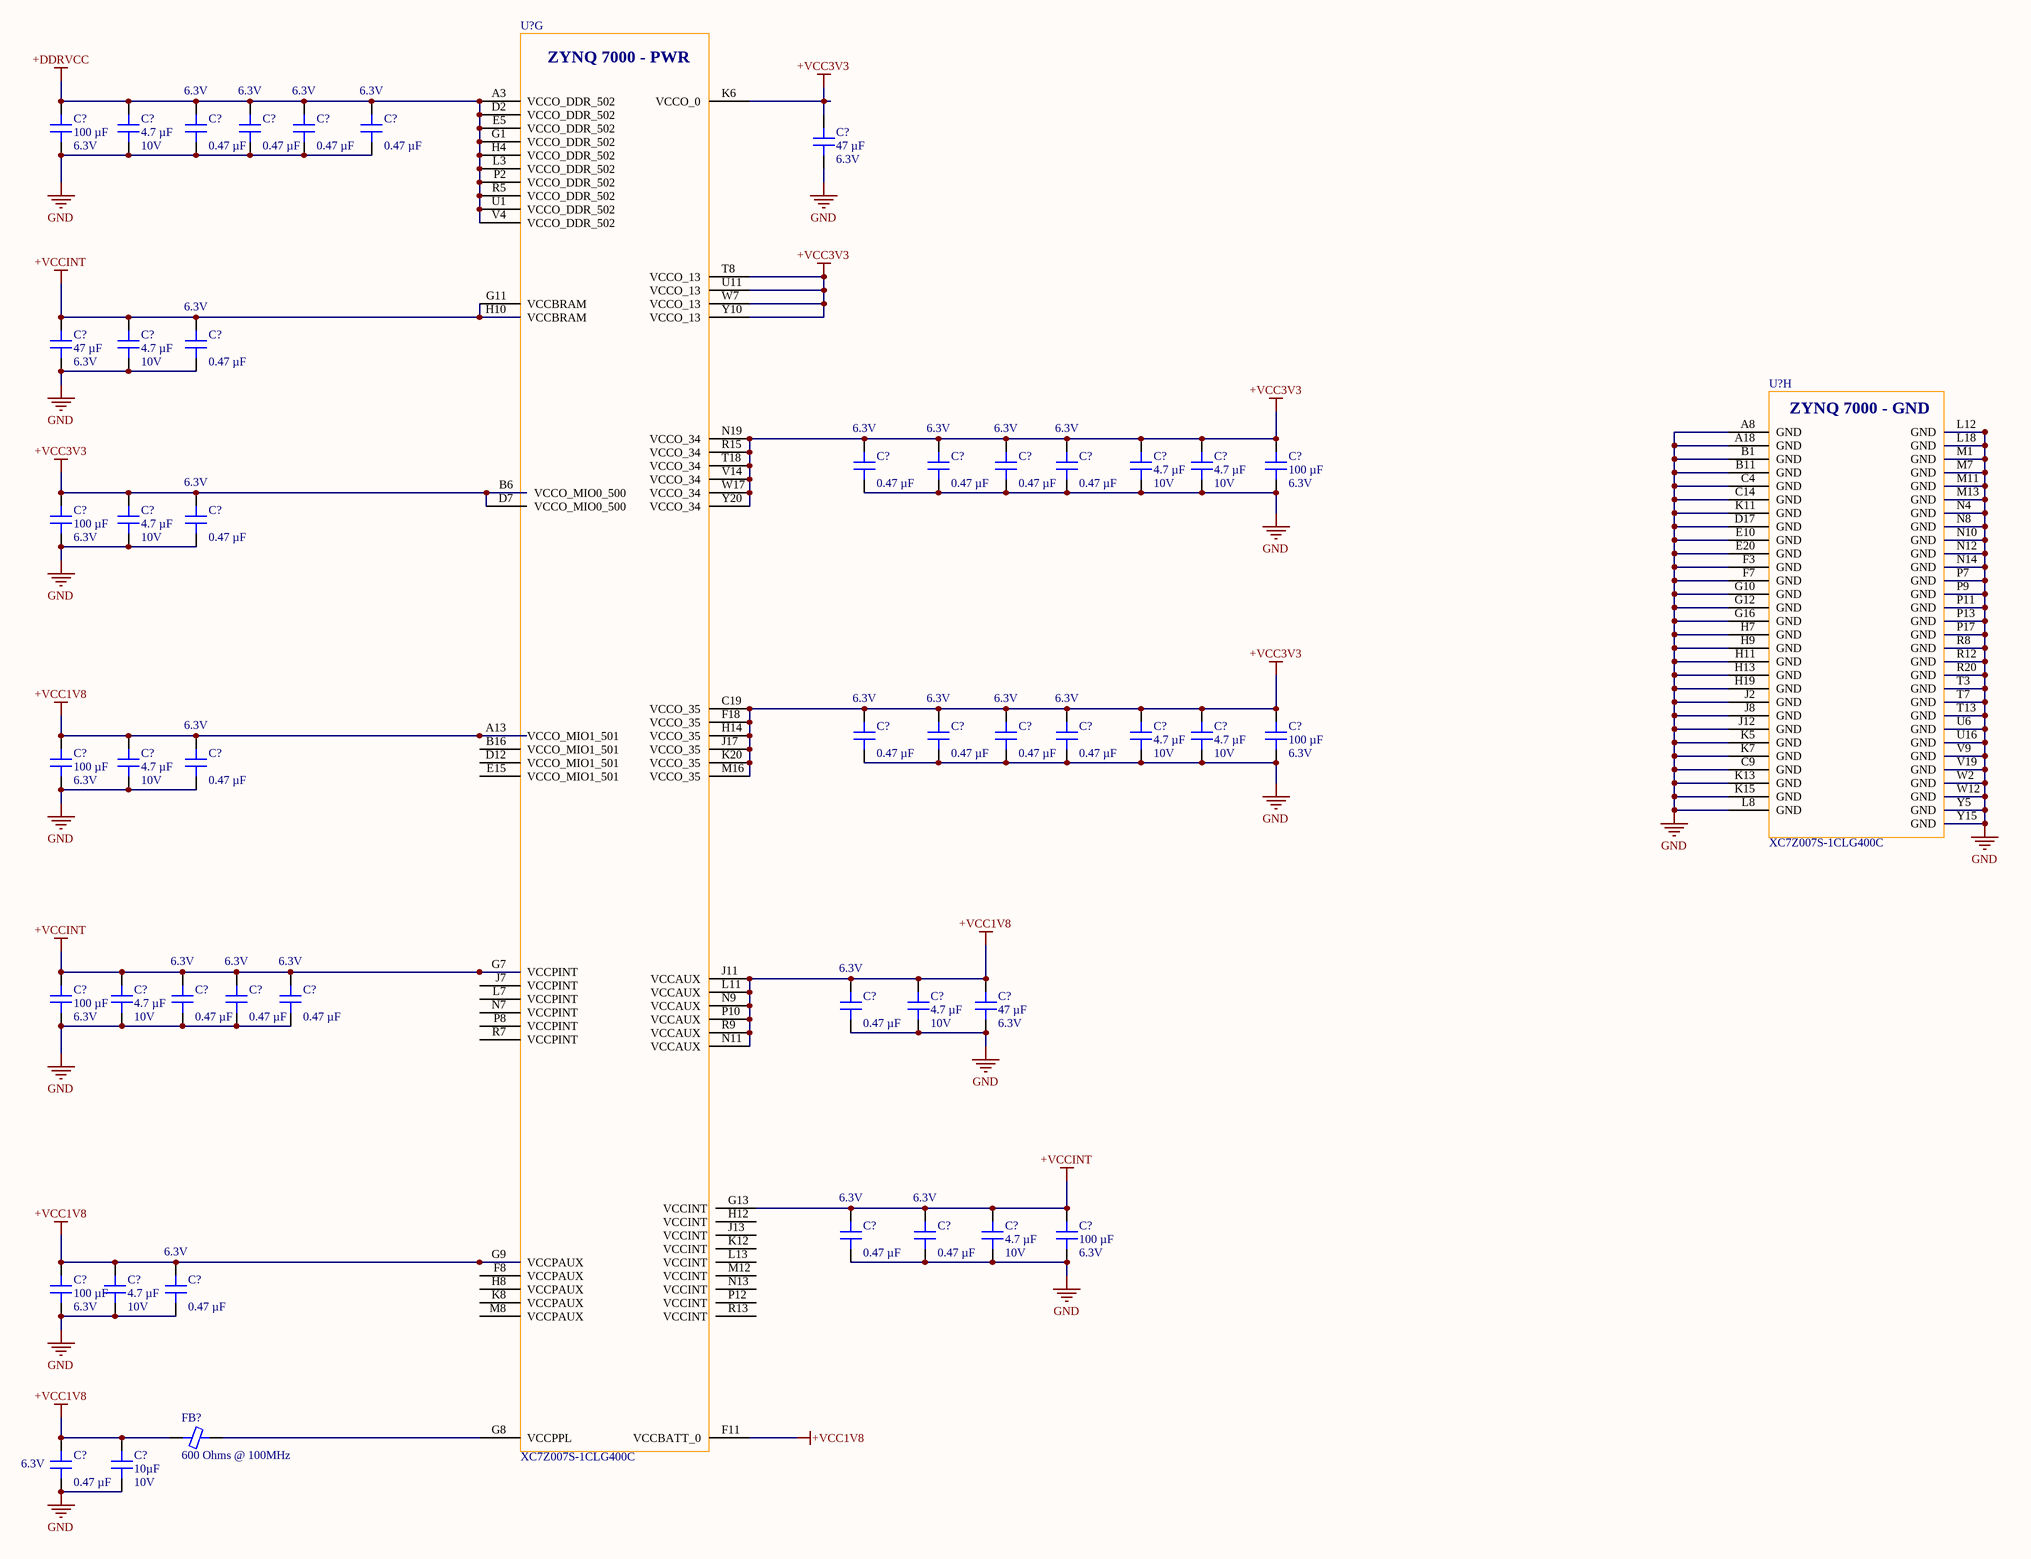
[diagram p2: [03] - FPGA - POWER.SchDoc]

### Parts
(Parts that share a designator on the sheet are numbered #1, #2 ... from top to bottom, then left to right.)
C?#28  Voltage - Rated: 6.3V  [CAP 1210_3225 - 1MM]  (hidden comment: 100 µF)
C?#29  Voltage - Rated: 10V  [CAP 0402_1005]  (hidden comment: 4.7 µF)
C?#30  Voltage - Rated: 6.3V  [CAP 0201_0603]  (hidden comment: 0.47 µF)
C?#31  Voltage - Rated: 6.3V  [CAP 0201_0603]  (hidden comment: 0.47 µF)
C?#32  Voltage - Rated: 6.3V  [CAP 0201_0603]  (hidden comment: 0.47 µF)
C?#33  Voltage - Rated: 6.3V  [CAP 0201_0603]  (hidden comment: 0.47 µF)
C?#34  Voltage - Rated: 6.3V  [CAP 0805_2012]  (hidden comment: 47 µF)
C?#35  Voltage - Rated: 6.3V  [CAP 0805_2012]  (hidden comment: 47 µF)
C?#36  Voltage - Rated: 10V  [CAP 0402_1005]  (hidden comment: 4.7 µF)
C?#37  Voltage - Rated: 6.3V  [CAP 0201_0603]  (hidden comment: 0.47 µF)
C?#38  Voltage - Rated: 6.3V  [CAP 0201_0603]  (hidden comment: 0.47 µF)
C?#39  Voltage - Rated: 6.3V  [CAP 0201_0603]  (hidden comment: 0.47 µF)
C?#40  Voltage - Rated: 6.3V  [CAP 0201_0603]  (hidden comment: 0.47 µF)
C?#41  Voltage - Rated: 6.3V  [CAP 0201_0603]  (hidden comment: 0.47 µF)
C?#42  Voltage - Rated: 10V  [CAP 0402_1005]  (hidden comment: 4.7 µF)
C?#43  Voltage - Rated: 10V  [CAP 0402_1005]  (hidden comment: 4.7 µF)
C?#44  Voltage - Rated: 6.3V  [CAP 1210_3225 - 1MM]  (hidden comment: 100 µF)
C?#45  Voltage - Rated: 6.3V  [CAP 1210_3225 - 1MM]  (hidden comment: 100 µF)
C?#46  Voltage - Rated: 10V  [CAP 0402_1005]  (hidden comment: 4.7 µF)
C?#47  Voltage - Rated: 6.3V  [CAP 0201_0603]  (hidden comment: 0.47 µF)
C?#48  Voltage - Rated: 6.3V  [CAP 0201_0603]  (hidden comment: 0.47 µF)
C?#49  Voltage - Rated: 6.3V  [CAP 0201_0603]  (hidden comment: 0.47 µF)
C?#50  Voltage - Rated: 6.3V  [CAP 0201_0603]  (hidden comment: 0.47 µF)
C?#51  Voltage - Rated: 6.3V  [CAP 0201_0603]  (hidden comment: 0.47 µF)
C?#52  Voltage - Rated: 10V  [CAP 0402_1005]  (hidden comment: 4.7 µF)
C?#53  Voltage - Rated: 10V  [CAP 0402_1005]  (hidden comment: 4.7 µF)
C?#54  Voltage - Rated: 6.3V  [CAP 1210_3225 - 1MM]  (hidden comment: 100 µF)
C?#55  Voltage - Rated: 6.3V  [CAP 1210_3225 - 1MM]  (hidden comment: 100 µF)
C?#56  Voltage - Rated: 10V  [CAP 0402_1005]  (hidden comment: 4.7 µF)
C?#57  Voltage - Rated: 6.3V  [CAP 0201_0603]  (hidden comment: 0.47 µF)
C?#58  Voltage - Rated: 6.3V  [CAP 1210_3225 - 1MM]  (hidden comment: 100 µF)
C?#59  Voltage - Rated: 10V  [CAP 0402_1005]  (hidden comment: 4.7 µF)
C?#60  Voltage - Rated: 6.3V  [CAP 0201_0603]  (hidden comment: 0.47 µF)
C?#61  Voltage - Rated: 6.3V  [CAP 0201_0603]  (hidden comment: 0.47 µF)
C?#62  Voltage - Rated: 6.3V  [CAP 0201_0603]  (hidden comment: 0.47 µF)
C?#63  Voltage - Rated: 6.3V  [CAP 0201_0603]  (hidden comment: 0.47 µF)
C?#64  Voltage - Rated: 10V  [CAP 0402_1005]  (hidden comment: 4.7 µF)
C?#65  Voltage - Rated: 6.3V  [CAP 0805_2012]  (hidden comment: 47 µF)
C?#66  Voltage - Rated: 6.3V  [CAP 0201_0603]  (hidden comment: 0.47 µF)
C?#67  Voltage - Rated: 6.3V  [CAP 0201_0603]  (hidden comment: 0.47 µF)
C?#68  Voltage - Rated: 10V  [CAP 0402_1005]  (hidden comment: 4.7 µF)
C?#69  Voltage - Rated: 6.3V  [CAP 1210_3225 - 1MM]  (hidden comment: 100 µF)
C?#70  Voltage - Rated: 6.3V  [CAP 1210_3225 - 1MM]  (hidden comment: 100 µF)
C?#71  Voltage - Rated: 10V  [CAP 0402_1005]  (hidden comment: 4.7 µF)
C?#72  Voltage - Rated: 6.3V  [CAP 0201_0603]  (hidden comment: 0.47 µF)
C?#73  Voltage - Rated: 6.3V  [CAP 0201_0603]  (hidden comment: 0.47 µF)
C?#74  Voltage - Rated: 10V  [CAP 0603_1608]  (hidden comment: 10µF)
FB?#3  600 Ohms @ 100MHz  [FER 0603_1608]
U?#2  XC7Z007S-1CLG400C  [CLG400_XIL]  (part G of 8)
U?#3  XC7Z007S-1CLG400C  [CLG400_XIL]  (part H of 8)

### Nets
+DDRVCC: C?#28.2 C?#29.2 C?#30.2 C?#31.2 C?#32.2 C?#33.2 U?#2.A3(VCCO_DDR_502) U?#2.D2(VCCO_DDR_502) U?#2.E5(VCCO_DDR_502) U?#2.G1(VCCO_DDR_502) U?#2.H4(VCCO_DDR_502) U?#2.L3(VCCO_DDR_502) U?#2.P2(VCCO_DDR_502) U?#2.R5(VCCO_DDR_502) U?#2.U1(VCCO_DDR_502) U?#2.V4(VCCO_DDR_502)
+VCC1V8: C?#55.2 C?#56.2 C?#57.2 C?#63.2 C?#64.2 C?#65.2 C?#70.2 C?#71.2 C?#72.2 C?#73.2 C?#74.2 FB?#3.1 U?#2.A13(VCCO_MIO1_501) U?#2.F11(VCCBATT_0) U?#2.G9(VCCPAUX) U?#2.J11(VCCAUX) U?#2.L11(VCCAUX) U?#2.N9(VCCAUX) U?#2.N11(VCCAUX) U?#2.P10(VCCAUX) U?#2.R9(VCCAUX)
+VCC3V3: C?#34.2 C?#38.2 C?#39.2 C?#40.2 C?#41.2 C?#42.2 C?#43.2 C?#44.2 C?#45.2 C?#46.2 C?#47.2 C?#48.2 C?#49.2 C?#50.2 C?#51.2 C?#52.2 C?#53.2 C?#54.2 U?#2.B6(VCCO_MIO0_500) U?#2.C19(VCCO_35) U?#2.D7(VCCO_MIO0_500) U?#2.F18(VCCO_35) U?#2.H14(VCCO_35) U?#2.J17(VCCO_35) U?#2.K6(VCCO_0) U?#2.K20(VCCO_35) U?#2.M16(VCCO_35) U?#2.N19(VCCO_34) U?#2.R15(VCCO_34) U?#2.T8(VCCO_13) U?#2.T18(VCCO_34) U?#2.U11(VCCO_13) U?#2.V14(VCCO_34) U?#2.W7(VCCO_13) U?#2.W17(VCCO_34) U?#2.Y10(VCCO_13) U?#2.Y20(VCCO_34)
+VCCINT: C?#35.2 C?#36.2 C?#37.2 C?#58.2 C?#59.2 C?#60.2 C?#61.2 C?#62.2 C?#66.2 C?#67.2 C?#68.2 C?#69.2 U?#2.G7(VCCPINT) U?#2.G11(VCCBRAM) U?#2.G13(VCCINT) U?#2.H10(VCCBRAM)
GND: C?#28.1 C?#29.1 C?#30.1 C?#31.1 C?#32.1 C?#33.1 C?#34.1 C?#35.1 C?#36.1 C?#37.1 C?#38.1 C?#39.1 C?#40.1 C?#41.1 C?#42.1 C?#43.1 C?#44.1 C?#45.1 C?#46.1 C?#47.1 C?#48.1 C?#49.1 C?#50.1 C?#51.1 C?#52.1 C?#53.1 C?#54.1 C?#55.1 C?#56.1 C?#57.1 C?#58.1 C?#59.1 C?#60.1 C?#61.1 C?#62.1 C?#63.1 C?#64.1 C?#65.1 C?#66.1 C?#67.1 C?#68.1 C?#69.1 C?#70.1 C?#71.1 C?#72.1 C?#73.1 C?#74.1 U?#3.A8(GND) U?#3.A18(GND) U?#3.B1(GND) U?#3.B11(GND) U?#3.C4(GND) U?#3.C9(GND) U?#3.C14(GND) U?#3.D17(GND) U?#3.E10(GND) U?#3.E20(GND) U?#3.F3(GND) U?#3.F7(GND) U?#3.G10(GND) U?#3.G12(GND) U?#3.G16(GND) U?#3.H7(GND) U?#3.H9(GND) U?#3.H11(GND) U?#3.H13(GND) U?#3.H19(GND) U?#3.J2(GND) U?#3.J8(GND) U?#3.J12(GND) U?#3.K5(GND) U?#3.K7(GND) U?#3.K11(GND) U?#3.K13(GND) U?#3.K15(GND) U?#3.L8(GND) U?#3.L12(GND) U?#3.L18(GND) U?#3.M1(GND) U?#3.M7(GND) U?#3.M11(GND) U?#3.M13(GND) U?#3.N4(GND) U?#3.N8(GND) U?#3.N10(GND) U?#3.N12(GND) U?#3.N14(GND) U?#3.P7(GND) U?#3.P9(GND) U?#3.P11(GND) U?#3.P13(GND) U?#3.P17(GND) U?#3.R8(GND) U?#3.R12(GND) U?#3.R20(GND) U?#3.T3(GND) U?#3.T7(GND) U?#3.T13(GND) U?#3.U6(GND) U?#3.U16(GND) U?#3.V9(GND) U?#3.V19(GND) U?#3.W2(GND) U?#3.W12(GND) U?#3.Y5(GND) U?#3.Y15(GND)
NetFB?#3_2: FB?#3.2 U?#2.G8(VCCPPL)

Not connected (* = marked no-connect by the designer): U?#2 B16(VCCO_MIO1_501) D12(VCCO_MIO1_501) E15(VCCO_MIO1_501) F8(VCCPAUX) H8(VCCPAUX) H12(VCCINT) J7(VCCPINT) J13(VCCINT) K8(VCCPAUX) K12(VCCINT) L7(VCCPINT) L13(VCCINT) M8(VCCPAUX) M12(VCCINT) N7(VCCPINT) N13(VCCINT) P8(VCCPINT) P12(VCCINT) R7(VCCPINT) R13(VCCINT)

### Notes on the sheet
- (in symbol XC7Z007S-1CLG400C, part G) ZYNQ 7000 - PWR
- (in symbol XC7Z007S-1CLG400C, part H) ZYNQ 7000 - GND

### Library data of the parts
C?#28 C?#44 C?#45 C?#54 C?#55 C?#58 C?#69 C?#70 = GRM32EC70J107ME15L: CAP CER 100UF 6.3V X7S 1210; manufacturer: Murata Electronics; Tolerance: ±20%; Part Number: GRM32EC70J107ME15L; Value: 100 µF; Applications: General Purpose; Capacitance: 100 µF; componentlink1description: Datasheet; componentlink1url: https://search.murata.co.jp/Ceramy/image/img/A01X/G101/ENG/GRM32EC70J107ME15-01.pdf; componentlink2description: DigiKey Link; componentlink2url: https://www.digikey.com/en/products/detail/murata-electronics/GRM32EC70J107ME15L/5027614; Device Package: 1210 (3225 Metric); lastupdated: 26.04.2023 19:29:36; Lifecycle Status: Active; Minimum Order: 1; Mounting Type: Surface Mount, MLCC; Operating Temperature: -55°C ~ 125°C; Package / Case: 1210 (3225 Metric); packaging: TapeAndReel; partid: 23659; Part Status: Active; price: 0.16; series: GRM; Size / Dimension: 0.126" L x 0.098" W (3.20mm x 2.50mm); Supplier 1: DigiKey; Supplier Part Number 1: 490-10530-1-ND; Temperature Coefficient: X7S; Thickness (Max): 0.106" (2.70mm)
C?#29 C?#36 C?#42 C?#43 C?#46 C?#52 C?#53 C?#56 C?#59 C?#64 C?#68 C?#71 = GMC04X5R475K10NT: CAP0402 X5R 4.7UF 10% 10V; manufacturer: Cal-Chip Electronics, Inc.; Part Number: GMC04X5R475K10NT; Value: 4.7 µF; Applications: General Purpose; Capacitance: 4.7 µF; componentlink1description: Datasheet; componentlink1url: https://88ce57.p3cdn1.secureserver.net/wp-content/uploads/2023/01/gmc_series-2.pdf; componentlink2description: DigiKey Link; componentlink2url: https://www.digikey.com/en/products/detail/cal-chip-electronics-inc/GMC04X5R475K10NT/18151135; Device Package: 0402 (1005 Metric); lastupdated: 26.04.2023 19:01:59; Lifecycle Status: Active; Minimum Order: 1; Mounting Type: Surface Mount, MLCC; Operating Temperature: -55°C ~ 85°C; Package / Case: 0402 (1005 Metric); packaging: TapeAndReel; partid: 49814; Part Status: Active; price: 0.01; series: GMC; Size / Dimension: 0.039" L x 0.020" W (1.00mm x 0.50mm); Supplier 1: DigiKey; Supplier Part Number 1: 4713-GMC04X5R475K10NTCT-ND; Temperature Coefficient: X5R; Thickness (Max): 0.028" (0.70mm); Tolerance: ±10%
C?#30-C?#33 C?#37-C?#41 C?#47-C?#51 C?#57 C?#60-C?#63 C?#66 C?#67 C?#72 C?#73 = JMK063BC6474KP-F: CAP CER 0.47UF 6.3V X6S 0201; manufacturer: Taiyo Yuden; Tolerance: ±10%; Part Number: JMK063BC6474KP-F; Value: 0.47 µF; Applications: SMPS Filtering; Capacitance: 0.47 µF; componentlink1description: Datasheet; componentlink1url: https://ds.yuden.co.jp/TYCOMPAS/ut/detail?pn=JMK063BC6474KP-F&u=M; componentlink2description: DigiKey Link; componentlink2url: https://www.digikey.com/en/products/detail/taiyo-yuden/JMK063BC6474KP-F/9947925; Device Package: 0201 (0603 Metric); lastupdated: 26.04.2023 19:00:46; Lifecycle Status: Active; Minimum Order: 1; Mounting Type: Surface Mount, MLCC; Operating Temperature: -55°C ~ 105°C; Package / Case: 0201 (0603 Metric); packaging: TapeAndReel; partid: 108; Part Status: Active; price: 0.01; series: M; Size / Dimension: 0.024" L x 0.012" W (0.60mm x 0.30mm); Supplier 1: DigiKey; Supplier Part Number 1: 587-6386-1-ND; Temperature Coefficient: X6S; Thickness (Max): 0.015" (0.39mm)
C?#34 C?#35 C?#65 = CL21A476MQYNNNE: CAP CER 47UF 6.3V X5R 0805; manufacturer: Samsung Electro-Mechanics; Tolerance: ±20%; Part Number: CL21A476MQYNNNE; Value: 47 µF; Applications: General Purpose; Capacitance: 47 µF; componentlink1description: Datasheet; componentlink1url: http://www.samsungsem.com/kr/support/product-search/mlcc/CL21A476MQYNNNE.jsp; componentlink2description: DigiKey Link; componentlink2url: https://www.digikey.com/en/products/detail/samsung-electro-mechanics/CL21A476MQYNNNE/3887510; Device Package: 0805 (2012 Metric); lastupdated: 26.04.2023 19:09:50; Lifecycle Status: Active; Minimum Order: 1; Mounting Type: Surface Mount, MLCC; Operating Temperature: -55°C ~ 85°C; Package / Case: 0805 (2012 Metric); packaging: TapeAndReel; partid: 3143; Part Status: Active; price: 0.04; series: CL; Size / Dimension: 0.079" L x 0.049" W (2.00mm x 1.25mm); Supplier 1: DigiKey; Supplier Part Number 1: 1276-1852-1-ND; Temperature Coefficient: X5R; Thickness (Max): 0.057" (1.45mm)
C?#74 = 0603ZD106KAT2A: CAP CER 10UF 10V X5R 0603; manufacturer: AVX Corporation; Tolerance: ±10%; Part Number: 0603ZD106KAT2A; Value: 10µF; Applications: General Purpose; Capacitance: 10µF; componentlink1description: Datasheet; componentlink1url: http://datasheets.avx.com/cx5r.pdf; componentlink2description: DigiKey Link; componentlink2url: http://digikey.com/product-detail/en/avx-corporation/0603ZD106KAT2A/478-10766-1-ND/7536554; Device Package: 0603 (1608 Metric); lastupdated: 2.09.2020 01:03:35; Lifecycle Status: Active; Minimum Order: 1; Mounting Type: Surface Mount, MLCC; Operating Temperature: -55°C ~ 85°C; Package / Case: 0603 (1608 Metric); packaging: TapeAndReel; partid: 2590; Part Status: Active; price: 0.08; series: -; Size / Dimension: 0.063" L x 0.032" W (1.60mm x 0.81mm); Supplier 1: DigiKey; Supplier Part Number 1: 478-10766-1-ND; Temperature Coefficient: X5R; Thickness (Max): 0.037" (0.94mm)
FB?#3 = BLM18DN601SZ1D: as FB?#1 on sheet [02] - POWER; Part Number: BLM18DN601SZ1D; ComponentLink1Description: Datasheet; ComponentLink1URL: https://www.murata.com/en-us/api/pdfdownloadapi?cate=luNoiseSupprFilteChipFerriBead&partno=BLM18DN601SZ1%23; ComponentLink2Description: DigiKey Link; ComponentLink2URL: http://digikey.com/product-detail/en/murata-electronics/BLM18DN601SZ1D/490-18575-1-ND/10135586; Device Package: 0603 (1608 Metric); Height (Max): 0.037" (0.95mm); Impedance @ Frequency: 600 Ohms @ 100MHz; LastUpdated: 2.09.2020 01:18:18; Lifecycle Status: Active; Minimum Order: 1; Mounting Type: Surface Mount; Operating Temperature: -55°C ~ 125°C; Package / Case: 0603 (1608 Metric); Packaging: TapeAndReel; PartId: 783; Part Status: Active; Price: 0.05; Ratings: AEC-Q200; Series: EMIFIL®, BLM18; Size / Dimension: 0.063" L x 0.031" W (1.60mm x 0.80mm); Supplier 1: DigiKey; Supplier Part Number 1: 490-18575-1-ND; Value: 600 Ohms @ 100MHz
U?#2 U?#3 = XC7Z007S-1CLG400C: No Description Available; Mfr_Name: Xilinx Inc; RefDes: RefDes; Type: Type